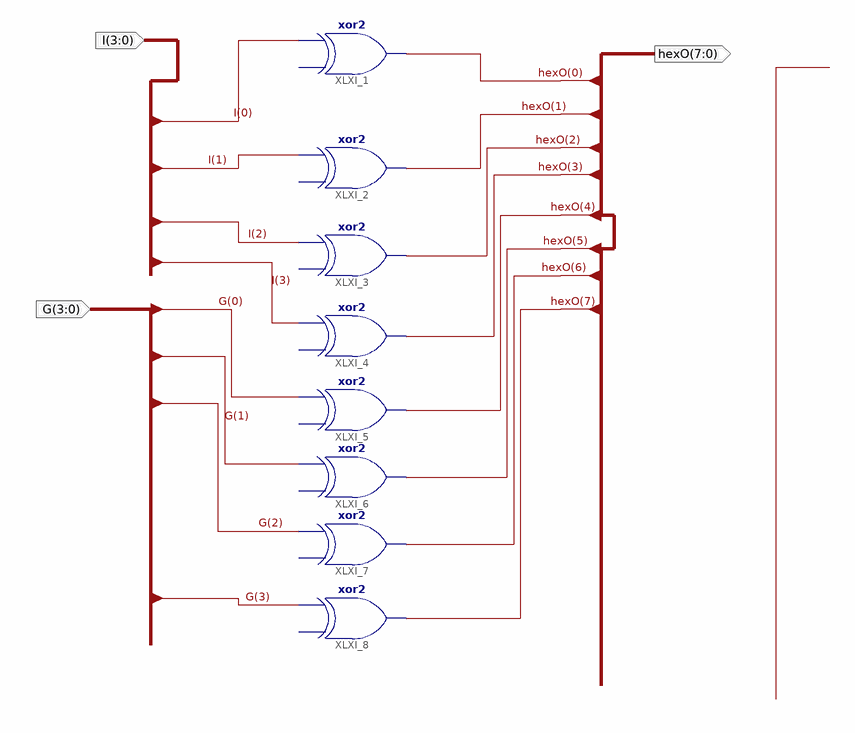
[diagram p0: schematic sheet 1]
// Xilinx ISE schematic hex8bits.sch (spartan3e) as structural Verilog: 8 symbols, 3 ports
module hex8bits (
  input  [3:0] I,
  input  [3:0] G,
  output [7:0] hexO
);

  buf XLXI_1 (hexO[0], I[0]);  // xor2 open: I0
  buf XLXI_2 (hexO[1], I[1]);  // xor2 open: I0
  buf XLXI_3 (hexO[2], I[2]);  // xor2 open: I0
  buf XLXI_4 (hexO[3], I[3]);  // xor2 open: I0
  buf XLXI_5 (hexO[4], G[0]);  // xor2 open: I0
  buf XLXI_6 (hexO[5], G[1]);  // xor2 open: I0
  buf XLXI_7 (hexO[6], G[2]);  // xor2 open: I0
  buf XLXI_8 (hexO[7], G[3]);  // xor2 open: I0
endmodule
